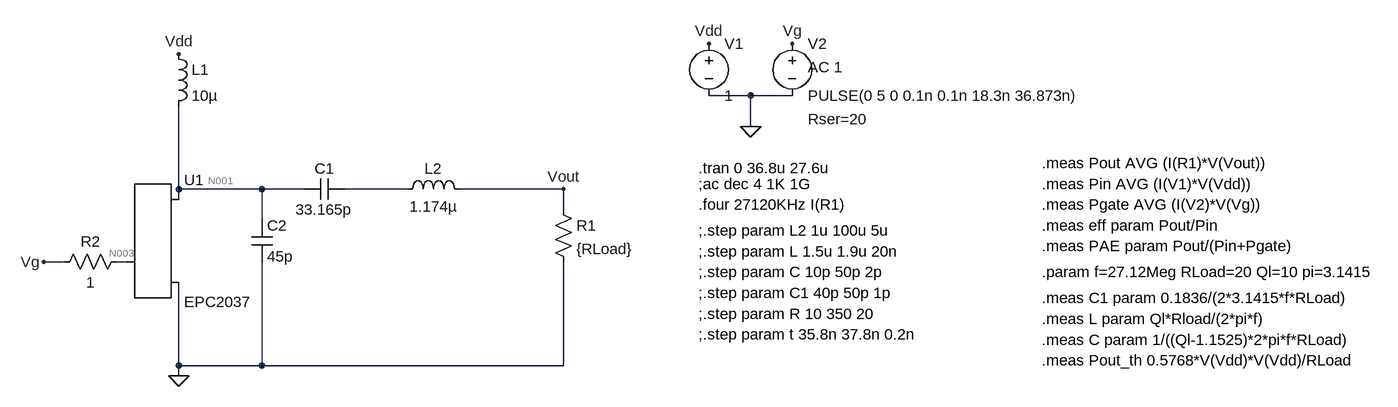
[diagram p0: schematic ClassE.asc]
ClassE.asc, the LTspice schematic file:
Version 4
SHEET 1 1944 680
WIRE 272 48 208 48
WIRE 336 48 272 48
WIRE 272 96 272 48
WIRE -608 192 -608 64
WIRE -480 192 -608 192
WIRE -416 192 -480 192
WIRE -256 192 -352 192
WIRE -16 192 -176 192
WIRE -608 208 -608 192
WIRE -16 224 -16 192
WIRE -480 240 -480 192
WIRE -784 304 -816 304
WIRE -688 304 -704 304
WIRE -608 464 -608 336
WIRE -480 464 -480 304
WIRE -480 464 -608 464
WIRE -16 464 -16 304
WIRE -16 464 -480 464
WIRE -608 480 -608 464
FLAG -608 -16 Vdd
FLAG -816 304 Vg
FLAG 272 96 0
FLAG 208 -32 Vdd
FLAG 336 -32 Vg
FLAG -16 192 Vout
FLAG -608 480 0
SYMBOL EPCGaN -688 304 R0
SYMATTR InstName U1
SYMATTR Value EPC2037
SYMBOL ind -624 -32 R0
SYMATTR InstName L1
SYMATTR Value 10µ
SYMATTR SpiceLine Rser=0.1
SYMBOL ind -272 208 R270
WINDOW 0 32 56 VTop 2
WINDOW 3 5 56 VBottom 2
SYMATTR InstName L2
SYMATTR Value 1.174µ
SYMATTR SpiceLine Rser=0.1
SYMBOL cap -352 176 R90
WINDOW 0 0 32 VBottom 2
WINDOW 3 32 32 VTop 2
SYMATTR InstName C1
SYMATTR Value 33.165p
SYMATTR SpiceLine Rser=0.1
SYMBOL res -32 208 R0
SYMATTR InstName R1
SYMATTR Value {RLoad}
SYMBOL voltage 208 -48 R0
WINDOW 123 0 0 Left 0
WINDOW 39 0 0 Left 0
SYMATTR InstName V1
SYMATTR Value 1
SYMBOL voltage 336 -48 R0
WINDOW 123 24 52 Left 2
WINDOW 39 24 132 Left 2
SYMATTR Value2 AC 1
SYMATTR SpiceLine Rser=20
SYMATTR InstName V2
SYMATTR Value PULSE(0 5 0 0.1n 0.1n 18.3n 36.873n)
SYMBOL cap -496 240 R0
SYMATTR InstName C2
SYMATTR Value 45p
SYMATTR SpiceLine Rser=0.1
SYMBOL res -688 288 R90
WINDOW 0 0 56 VBottom 2
WINDOW 3 32 56 VTop 2
SYMATTR InstName R2
SYMATTR Value 1
TEXT 192 160 Left 2 !.tran 0 36.8u 27.6u
TEXT 192 184 Left 2 !;ac dec 4 1K 1G
TEXT 192 288 Left 2 !;.step param L 1.5u 1.9u 20n
TEXT 720 152 Left 2 !.meas Pout AVG (I(R1)*V(Vout))
TEXT 720 184 Left 2 !.meas Pin AVG (I(V1)*V(Vdd))
TEXT 720 248 Left 2 !.meas eff param Pout/Pin
TEXT 192 216 Left 2 !.four 27120KHz I(R1)
TEXT 192 384 Left 2 !;.step param R 10 350 20
TEXT 192 256 Left 2 !;.step param L2 1u 100u 5u
TEXT 192 320 Left 2 !;.step param C 10p 50p 2p
TEXT 192 352 Left 2 !;.step param C1 40p 50p 1p
TEXT 192 416 Left 2 !;.step param t 35.8n 37.8n 0.2n
TEXT 720 320 Left 2 !.param f=27.12Meg RLoad=20 Ql=10 pi=3.1415
TEXT 720 216 Left 2 !.meas Pgate AVG (I(V2)*V(Vg))
TEXT 720 280 Left 2 !.meas PAE param Pout/(Pin+Pgate)
TEXT 720 360 Left 2 !.meas C1 param 0.1836/(2*3.1415*f*RLoad)
TEXT 720 392 Left 2 !.meas L param Ql*Rload/(2*pi*f)
TEXT 720 424 Left 2 !.meas C param 1/((Ql-1.1525)*2*pi*f*RLoad)
TEXT 720 456 Left 2 !.meas Pout_th 0.5768*V(Vdd)*V(Vdd)/RLoad

The netlist it stands for:
* ClassE.asc
XU1 N003 N001 0 EPC2037
L1 Vdd N001 10µ Rser=0.1
L2 N002 Vout 1.174µ Rser=0.1
C1 N002 N001 33.165p Rser=0.1
R1 Vout 0 {RLoad}
V1 Vdd 0 1
V2 Vg 0 PULSE(0 5 0 0.1n 0.1n 18.3n 36.873n) AC 1 Rser=20
C2 N001 0 45p Rser=0.1
R2 N003 Vg 1
.tran 0 36.8u 27.6u
;ac dec 4 1K 1G
;.step param L 1.5u 1.9u 20n
.meas Pout AVG (I(R1)*V(Vout))
.meas Pin AVG (I(V1)*V(Vdd))
.meas eff param Pout/Pin
.four 27120KHz I(R1)
;.step param R 10 350 20
;.step param L2 1u 100u 5u
;.step param C 10p 50p 2p
;.step param C1 40p 50p 1p
;.step param t 35.8n 37.8n 0.2n
.param f=27.12Meg RLoad=20 Ql=10 pi=3.1415
.meas Pgate AVG (I(V2)*V(Vg))
.meas PAE param Pout/(Pin+Pgate)
.meas C1 param 0.1836/(2*3.1415*f*RLoad)
.meas L param Ql*Rload/(2*pi*f)
.meas C param 1/((Ql-1.1525)*2*pi*f*RLoad)
.meas Pout_th 0.5768*V(Vdd)*V(Vdd)/RLoad
.backanno
.end

* Results of the author's LTspice run, read from the files saved beside the schematic
* Operating Point, zero values left out:
*   V(n001) = 1 V
*   V(n003) = 15.32 nV
*   V(vdd) = 1 V
*   V(vg) = 14.59 nV
*   I(L1) = 37.91 nA
*   I(R2) = 729.7 pA
*   I(V2) = 729.7 pA
*   I(V1) = -37.91 nA
*   Ix(u1:GATEIN) = -729.7 pA
*   Ix(u1:DRAININ) = 37.91 nA
*   Ix(u1:SOURCEIN) = -37.18 nA
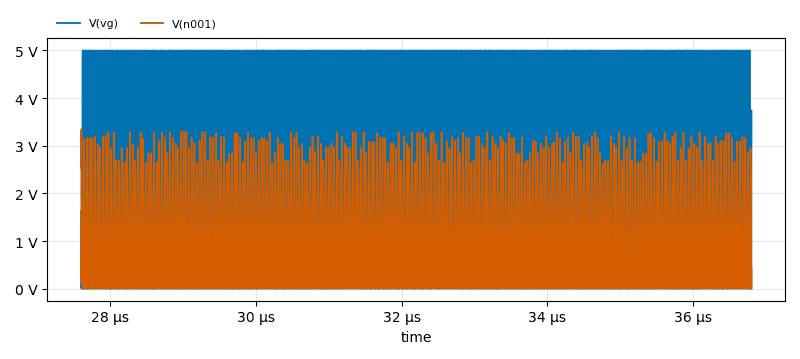
[diagram p1: Transient Analysis of ClassE.asc, plotted from the saved traces]
* Transient Analysis, 1 run:
*   V(vg): min -2.21 mV, max 5.001 V, average 2.49 V, rms 3.488 V, last 4.07 V
*   V(n001): min 1.78 mV, max 3.35 V, average 986.6 mV, rms 1.572 V, last 3.518 mV
* From the log:
*   N-Period=1
*   Fourier components of I(r1)
*   DC component:3.88699e-005
*   Harmonic  Frequency   Fourier   Normalized   Phase    Normalized
*    Number     [Hz]     Component   Component  [degree]  Phase [deg]
*       1     2.712e+07  4.777e-02  1.000e+00    -37.71°      0.00°
*       2     5.424e+07  2.442e-03  5.112e-02   -139.00°   -101.29°
*       3     8.136e+07  4.909e-04  1.028e-02    -71.30°    -33.59°
*       4     1.085e+08  1.437e-04  3.009e-03    173.65°    211.36°
*       5     1.356e+08  9.348e-05  1.957e-03   -158.11°   -120.40°
*       6     1.627e+08  1.064e-04  2.228e-03    168.84°    206.55°
*       7     1.898e+08  6.355e-05  1.330e-03     -3.17°     34.54°
*       8     2.170e+08  3.540e-05  7.412e-04   -138.18°   -100.47°
*       9     2.441e+08  6.778e-05  1.419e-03     80.84°    118.55°
*   Total Harmonic Distortion: 5.235471%(5.247990%)
*   pout: AVG(i(r1)*v(vout))=0.0229241 FROM 0 TO 9.2e-006
*   pin: AVG(i(v1)*v(vdd))=-0.0246873 FROM 0 TO 9.2e-006
*   eff: pout/pin=-0.92858
*   pgate: AVG(i(v2)*v(vg))=-0.00100332 FROM 0 TO 9.2e-006
*   pae: pout/(pin+pgate)=-0.892316
*   c1: 0.1836/(2*3.1415*f*rload)=5.38748e-011
*   l: ql*rload/(2*pi*f)=1.17371e-006
*   c: 1/((ql-1.1525)*2*pi*f*rload)=3.3165e-011
*   pout_th=9.2e-006 FROM 0 TO 9.2e-006